# EAGLE design knxhome (EAGLE 9.1.3)
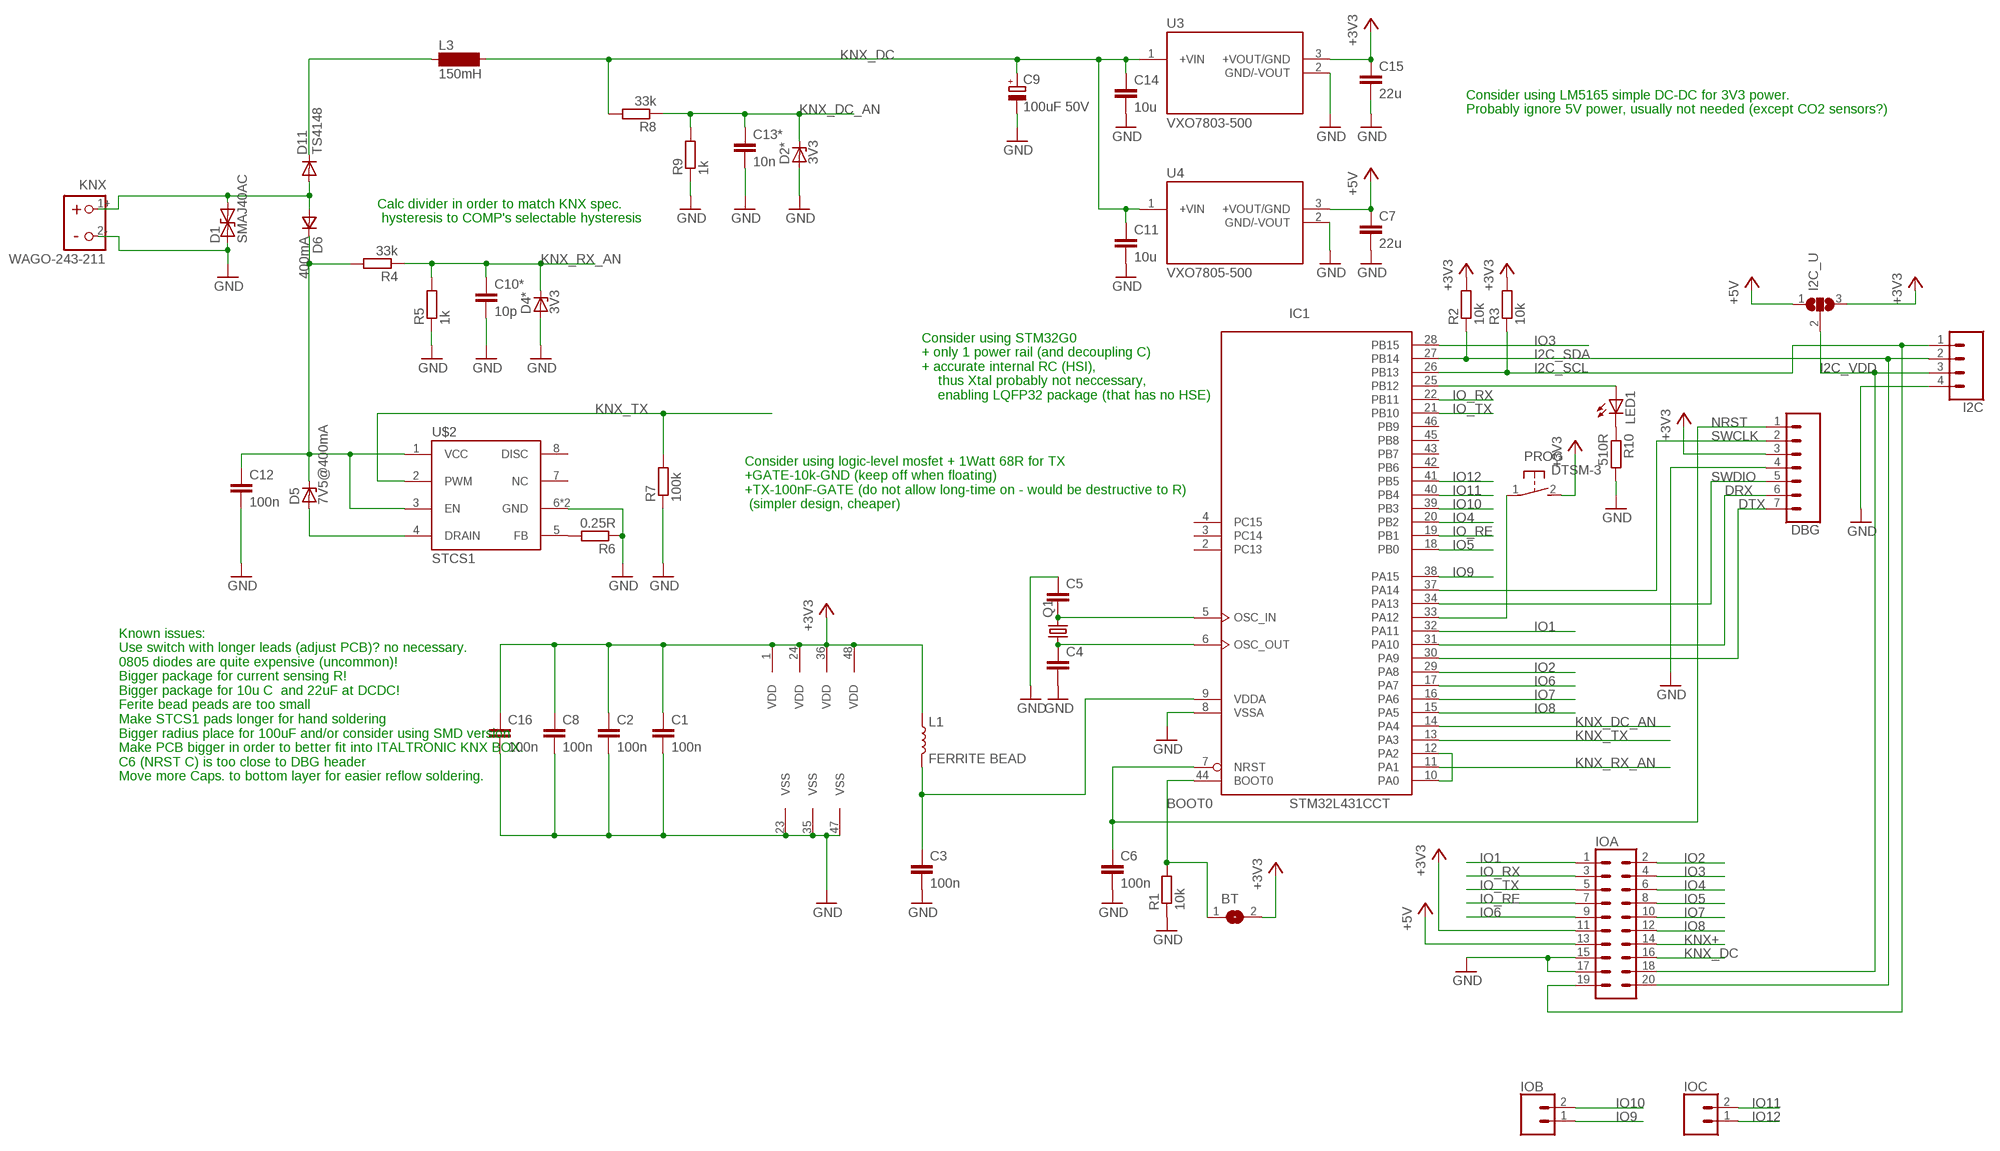
[diagram p0: schematic, sheet 1]

## Parts
BT  SJ  [SJ]
C1  100n  C-EUC0805  [C0805]
C2  100n  C-EUC0805  [C0805]
C3  100n  C-EUC0805  [C0805]
C4  C-EUC0805  [C0805]
C5  C-EUC0805  [C0805]
C6  100n  C-EUC0805  [C0805]
C7  22u  C-EUC0805  [C0805]
C8  100n  C-EUC0805  [C0805]
C9  100uF 50V  CPOL-EUE3.5-8  [E3,5-8]
C10*  10p  C-EUC0805  [C0805]
C11  10u  C-EUC0805  [C0805]
C12  100n  C-EUC0805  [C0805]
C13*  10n  C-EUC0805  [C0805]
C14  10u  C-EUC0805  [C0805]
C15  22u  C-EUC0805  [C0805]
C16  100n  C-EUC0805  [C0805]
D1  SMAJ40AC  [DO-214AC]
D2*  3V3  ZENER-DIODESOT23  [SOT23]
D4*  3V3  ZENER-DIODESOT23  [SOT23]
D5  7V5@400mA  ZENER-DIODESMB  [SMB]
D6  400mA  DSOD323  [SOD323]
D11  TS4148  DIODE-D0805  [D0805]
DBG  CONN_07LOCK  [1X07_LOCK]
I2C  CONN_04JST-PTH-VERT  [JST-4-PTH-VERT]
I2C_U  SJ2W  [SJ_2]
IC1  STM32L431CCT  STM32L051C8T  [LQFP48]
IOA  CONN_10X2  [2X10]
IOB  CONN_02  [1X02]
IOC  CONN_02  [1X02]
KNX  WAGO-243-211  [WAGO-243-211]
L1  FERRITE BEAD  INDUCTOR-0805-3.3UH  [0805]
L3  150mH  SD12BS11_LIEGEND  [BS11_LIEGEND]
LED1  LED3MM  [LED3MM]
PROG  DTSM-3  [DTSM-3]
Q1  CRYSTALHC49S  [HC49/S]
R1  10k  R-EU_R0805  [R0805]
R2  10k  R-EU_R0805  [R0805]
R3  10k  R-EU_R0805  [R0805]
R4  33k  R-EU_R0805  [R0805]
R5  1k  R-EU_R0805  [R0805]
R6  0.25R  R-EU_R0805  [R0805]
R7  100k  R-EU_R0805  [R0805]
R8  33k  R-EU_R0805  [R0805]
R9  1k  R-EU_R0805  [R0805]
R10  510R  R-EU_R0805  [R0805]
U3  VXO7803-500  [CONV_VXO7803-500]
U4  VXO7805-500  VXO7803-500  [CONV_VXO7803-500]
U$2  STCS1  [POWERSO-8]

## Nets
+3V3: BT.2 C1.1 C2.1 C8.1 C15.1 C16.1 DBG.3 I2C_U.3 IC1.1(VDD) IC1.24(VDD) IC1.36(VDD) IC1.48(VDD) IOA.11 L1.1 PROG.2 R2.2 R3.2 U3.3(+VOUT/GND)
+5V: C7.1 I2C_U.1 IOA.13 U4.3(+VOUT/GND)
BOOT0: BT.1 IC1.44(BOOT0) R1.2
BTN: IC1.33(PA12) PROG.1
DRX: DBG.6 IC1.31(PA10)
DTX: DBG.7 IC1.30(PA9)
GND: C1.2 C2.2 C3.2 C4.2 C5.1 C6.2 C7.2 C8.2 C9.- C10*.2 C11.2 C12.2 C13*.2 C14.2 C15.2 C16.2 D1.A D2*.1(A) D4*.1(A) DBG.4 I2C.4 IC1.8(VSSA) IC1.23(VSS) IC1.35(VSS) IC1.47(VSS) IOA.15 IOA.17 KNX.2- R1.1 R5.1 R6.1 R7.1 R9.1 R10.2 U3.2(GND/-VOUT) U4.2(GND/-VOUT) U$2.6(GND) U$2.EX(GND)
I2C_SCL: I2C.1 IC1.26(PB13) IOA.19 R3.1
I2C_SDA: I2C.2 IC1.27(PB14) IOA.20 R2.1
I2C_VDD: I2C.3 I2C_U.2 IOA.18
IO1: IC1.32(PA11) IOA.1
IO2: IC1.29(PA8) IOA.2
IO3: IC1.28(PB15) IOA.4
IO4: IC1.20(PB2) IOA.6
IO5: IC1.18(PB0) IOA.8
IO6: IC1.17(PA7) IOA.9
IO7: IC1.16(PA6) IOA.10
IO8: IC1.15(PA5) IOA.12
IO9: IC1.38(PA15) IOB.1
IO10: IC1.39(PB3) IOB.2
IO11: IC1.40(PB4) IOC.2
IO12: IC1.41(PB5) IOC.1
IO_RE: IC1.19(PB1) IOA.7
IO_RX: IC1.22(PB11) IOA.3
IO_TX: IC1.21(PB10) IOA.5
KNX+ [power]: D1.C D6.2(A) D11.A IOA.14 KNX.1+
KNX_DC: C9.+ C11.1 C14.1 IOA.16 L3.2 R8.2 U3.1(+VIN) U4.1(+VIN)
KNX_DC_AN: C13*.1 D2*.3(C) IC1.14(PA4) R8.1 R9.2
KNX_RECT: C12.1 D5.C D6.1(C) R4.2 U$2.1(VCC) U$2.3(EN)
KNX_RX_AN: C10*.1 D4*.3(C) IC1.11(PA1) R4.1 R5.2
KNX_TX: IC1.13(PA3) R7.2 U$2.2(PWM)
LED: IC1.25(PB12) LED1.A
N$1: D11.C L3.1
N$3: R6.2 U$2.5(FB)
N$4: LED1.K(C) R10.1
N$5: IC1.10(PA0) IC1.12(PA2)
N$7: C4.1 IC1.6(OSC_OUT) Q1.1
N$8: C5.2 IC1.5(OSC_IN) Q1.2
NRST: C6.1 DBG.1 IC1.7(NRST)
REF: D5.A U$2.4(DRAIN)
SWCLK: DBG.2 IC1.37(PA14)
SWDIO: DBG.5 IC1.34(PA13)
VDDA: C3.1 IC1.9(VDDA) L1.2
Unconnected: IC1.2(PC13) IC1.3(PC14) IC1.4(PC15) IC1.42(PB6) IC1.43(PB7) IC1.45(PB8) IC1.46(PB9) U$2.7(NC) U$2.8(DISC)

## Notes on the sheet
- Consider using LM5165 simple DC-DC for 3V3 power.
  Probably ignore 5V power, usually not needed (except CO2 sensors?)
- Calc divider in order to match KNX spec.
   hysteresis to COMP's selectable hysteresis
- Consider using STM32G0
  + only 1 power rail (and decoupling C)
  + accurate internal RC (HSI), 
      thus Xtal probably not neccessary,
      enabling LQFP32 package (that has no HSE)
- Consider using logic-level mosfet + 1Watt 68R for TX
  +GATE-10k-GND (keep off when floating)
  +TX-100nF-GATE (do not allow long-time on - would be destructive to R)
   (simpler design, cheaper)
- Known issues:
  Use switch with longer leads (adjust PCB)? no necessary.
  0805 diodes are quite expensive (uncommon)!
  Bigger package for current sensing R!
  Bigger package for 10u C  and 22uF at DCDC!
  Ferite bead peads are too small
  Make STCS1 pads longer for hand soldering
  Bigger radius place for 100uF and/or consider using SMD version
  Make PCB bigger in order to better fit into ITALTRONIC KNX BOX.
  C6 (NRST C) is too close to DBG header
  Move more Caps. to bottom layer for easier reflow soldering.

## Library data of the parts
BT = jumper:SJ: SMD solder JUMPER
C1-C8 C10* C11 C12 C13* C14-C16 = rcl:C-EU: CAPACITOR, European symbol; SPICEPREFIX: C
C9 = rcl:CPOL-EU: POLARIZED CAPACITOR, European symbol
D1 = diode:SMAJ40AC
D2* D4* D5 = diode:ZENER-DIODE: Z-Diode
D6 = zetex:D: DIODE; MPN: CDSOD323-T05C; OC_FARNELL: 1824860; OC_NEWARK: 79R6078
D11 = diode:DIODE-: DIODE
DBG = SparkFun-Connectors:CONN_07: Multi connection point. Often used as Generic Header-pin footprint for 0.1 inch spaced/style header connections On any of the 0.1 inch spaced packages, you can populate with these: Break Away Headers - Straight <https://www.sparkfun.com/products/116> (PRT-00116) Break Away Male Headers - Right Angle <https://www.sparkfun.com/products/553> (PRT-00553) Female Headers <https://www.sparkfun.com/products/115> (PRT-00115) Break Away Headers - Machine Pin <https://www.sparkfun.com/products/117> (PRT-00117) Break Away Female Headers - Swiss Machine Pin <https://www.sparkfun.com/products/743> (PRT-00743) For SCREWTERMINALS and SPRING TERMINALS visit here: Screw Terimnals on SparkFun.com <https://www.sparkfun.com/search/results?term=Screw+Terminals> (5mm/3.5mm/2.54mm spacing) This device is also useful as a general connection point to wire up your design to another part of your project. Our various solder wires solder well into these plated through hole pads. Hook-Up Wire - Assortment (Stranded, 22 AWG) <https://www.sparkfun.com/products/11375> (PRT-11375) Hook-Up Wire - Assortment (Solid Core, 22 AWG) <https://www.sparkfun.com/products/11367> (PRT-11367) View the entire wire category on our website here <https://www.sparkfun.com/categories/141> Special notes: Molex polarized connector foot print use with SKU : PRT-08231 with associated crimp pins and housings. 1MM SMD Version SKU: PRT-10208 NOTES ON THE VARIANTS LOCK and LOCK_LONGPADS... This footprint was designed to help hold the alignment of a through-hole component (i.e. 6-pin header) while soldering it into place. You may notice that each hole has been shifted either up or down by 0.005 of an inch from it's more standard position (which is a perfectly straight line). This slight alteration caused the pins (the squares in the middle) to touch the edges of the holes. Because they are alternating, it causes a "brace" to hold the component in place. 0.005 has proven to be the perfect amount of "off-center" position when using our standard breakaway headers. Although looks a little odd when you look at the bare footprint, once you have a header in there, the alteration is very hard to notice. Also,if you push a header all the way into place, it is covered up entirely on the bottom side.
I2C = SparkFun-Connectors:CONN_04: Multi connection point. Often used as Generic Header-pin footprint for 0.1 inch spaced/style header connections On any of the 0.1 inch spaced packages, you can populate with these: Break Away Headers - Straight <https://www.sparkfun.com/products/116> (PRT-00116) Break Away Male Headers - Right Angle <https://www.sparkfun.com/products/553> (PRT-00553) Female Headers <https://www.sparkfun.com/products/115> (PRT-00115) Break Away Headers - Machine Pin <https://www.sparkfun.com/products/117> (PRT-00117) Break Away Female Headers - Swiss Machine Pin <https://www.sparkfun.com/products/743> (PRT-00743) For SCREWTERMINALS and SPRING TERMINALS visit here: Screw Terimnals on SparkFun.com <https://www.sparkfun.com/search/results?term=Screw+Terminals> (5mm/3.5mm/2.54mm spacing) This device is also useful as a general connection point to wire up your design to another part of your project. Our various solder wires solder well into these plated through hole pads. Hook-Up Wire - Assortment (Stranded, 22 AWG) <https://www.sparkfun.com/products/11375> (PRT-11375) Hook-Up Wire - Assortment (Solid Core, 22 AWG) <https://www.sparkfun.com/products/11367> (PRT-11367) View the entire wire category on our website here <https://www.sparkfun.com/categories/141> Special notes: Molex polarized connector foot print use with SKU : PRT-08231 with associated crimp pins and housings. 1MM SMD Version SKU: PRT-10208; PROD_ID: CONN-13251
I2C_U = jumper:SJ2W: SMD solder JUMPER
IC1 = micro-stm_v3:STM32L051C*T: ARM 32-bit Cortex™-M0+ CPU 32 MHz maximum frequency 32 to 64 Kbytes of Flash memory 2 kbyte of Data EEPROM 8 kbytes of SRAM 37 GPIOs 1.8 to 3.6 V application supply
IOA = SparkFun-Connectors:CONN_10X2: Multi connection point. Often used as Generic Header-pin footprint for 0.1 inch spaced/style header connections On any of the 0.1 inch spaced packages, you can populate with these: Break Away Headers - Straight <https://www.sparkfun.com/products/116> (PRT-00116) Break Away Male Headers - Right Angle <https://www.sparkfun.com/products/553> (PRT-00553) Female Headers <https://www.sparkfun.com/products/115> (PRT-00115) Break Away Headers - Machine Pin <https://www.sparkfun.com/products/117> (PRT-00117) Break Away Female Headers - Swiss Machine Pin <https://www.sparkfun.com/products/743> (PRT-00743) Special note about the "SPECIAL" package: This was SPECIALLY designed to be used with our Graphic LCD Backpack. Be sure you want to use this! It is not only staggered on each line of header holes, but IT IS ALSO offset of the center point of the top and bottom lines by 5 mil. This causes the headers to lock into place on the "standard" footprint on the LCD screen. The extra squares on the tdocu layer are there simply to reference other pins (if you were to actually populate a longer header than ten long - this is what we do with the backpacks).
IOB IOC = SparkFun-Connectors:CONN_02: Multi connection point. Often used as Generic Header-pin footprint for 0.1 inch spaced/style header connections On any of the 0.1 inch spaced packages, you can populate with these: Break Away Headers - Straight <https://www.sparkfun.com/products/116> (PRT-00116) Break Away Male Headers - Right Angle <https://www.sparkfun.com/products/553> (PRT-00553) Female Headers <https://www.sparkfun.com/products/115> (PRT-00115) Break Away Headers - Machine Pin <https://www.sparkfun.com/products/117> (PRT-00117) Break Away Female Headers - Swiss Machine Pin <https://www.sparkfun.com/products/743> (PRT-00743) For SCREWTERMINALS and SPRING TERMINALS visit here: Screw Terimnals on SparkFun.com <https://www.sparkfun.com/search/results?term=Screw+Terminals> (5mm/3.5mm/2.54mm spacing) This device is also useful as a general connection point to wire up your design to another part of your project. Our various solder wires solder well into these plated through hole pads. Hook-Up Wire - Assortment (Stranded, 22 AWG) <https://www.sparkfun.com/products/11375> (PRT-11375) Hook-Up Wire - Assortment (Solid Core, 22 AWG) <https://www.sparkfun.com/products/11367> (PRT-11367) View the entire wire category on our website here <https://www.sparkfun.com/categories/141> Special notes: Molex polarized connector foot print use with: PRT-08233 with associated crimp pins and housings. 2.54_SCREWTERM for use with PRT-10571. 3.5mm Screw Terminal footprints for PRT-08084 5mm Screw Terminal footprints for use with PRT-08432
KNX = Connector_for_Selfbus-Projects:WAGO-243-211: WAGO KNX-Busklemme
L1 = SparkFun-Coils:INDUCTOR: Inductors Resist changes in electrical current. Basically a coil of wire. SparkFun Products: SparkFun Load Cell Amplifier - HX711 <https://www.sparkfun.com/products/13879> IOIO-OTG - V2.2 <https://www.sparkfun.com/products/13613>; PROD_ID: NDUC-13076; VALUE: 3.3µH/±20%/450mA
L3 = inductor-neosid:SD12: INDUCTOR nominal inductance
LED1 = led:LED: LED OSRAM: - CHIPLED LG R971, LG N971, LY N971, LG Q971, LY Q971, LO R971, LY R971 LH N974, LH R974 LS Q976, LO Q976, LY Q976 LO Q996 - Hyper CHIPLED LW Q18S LB Q993, LB Q99A, LB R99A - SideLED LS A670, LO A670, LY A670, LG A670, LP A670 LB A673, LV A673, LT A673, LW A673 LH A674 LY A675 LS A676, LA A676, LO A676, LY A676, LW A676 LS A679, LY A679, LG A679 - Hyper Micro SIDELED® LS Y876, LA Y876, LO Y876, LY Y876 LT Y87S - SmartLED LW L88C, LW L88S LB L89C, LB L89S, LG L890 LS L89K, LO L89K, LY L89K LS L896, LA L896, LO L896, LY L896 - TOPLED LS T670, LO T670, LY T670, LG T670, LP T670 LSG T670, LSP T670, LSY T670, LOP T670, LYG T670 LG T671, LOG T671, LSG T671 LB T673, LV T673, LT T673, LW T673 LH T674 LS T676, LA T676, LO T676, LY T676, LB T676, LH T676, LSB T676, LW T676 LB T67C, LV T67C, LT T67C, LS T67K, LO T67K, LY T67K, LW E67C LS E67B, LA E67B, LO E67B, LY E67B, LB E67C, LV E67C, LT E67C LW T67C LS T679, LY T679, LG T679 LS T770, LO T770, LY T770, LG T770, LP T770 LB T773, LV T773, LT T773, LW T773 LH T774 LS E675, LA E675, LY E675, LS T675 LS T776, LA T776, LO T776, LY T776, LB T776 LHGB T686 LT T68C, LB T68C - Hyper Mini TOPLED® LB M676 - Mini TOPLED Santana® LG M470 LS M47K, LO M47K, LY M47K Source: http://www.osram.convergy.de LUXEON: - LUMILED® LXK2-PW12-R00, LXK2-PW12-S00, LXK2-PW14-U00, LXK2-PW14-V00 LXK2-PM12-R00, LXK2-PM12-S00, LXK2-PM14-U00 LXK2-PE12-Q00, LXK2-PE12-R00, LXK2-PE12-S00, LXK2-PE14-T00, LXK2-PE14-U00 LXK2-PB12-K00, LXK2-PB12-L00, LXK2-PB12-M00, LXK2-PB14-N00, LXK2-PB14-P00, LXK2-PB14-Q00 LXK2-PR12-L00, LXK2-PR12-M00, LXK2-PR14-Q00, LXK2-PR14-R00 LXK2-PD12-Q00, LXK2-PD12-R00, LXK2-PD12-S00 LXK2-PH12-R00, LXK2-PH12-S00 LXK2-PL12-P00, LXK2-PL12-Q00, LXK2-PL12-R00 Source: www.luxeon.com KINGBRIGHT: KA-3528ASYC Source: www.kingbright.com
PROG = switch-tact:DTSM-3
Q1 = crystal:CRYSTAL: CRYSTAL; OC_FARNELL: 1667008; OC_NEWARK: unknown
R1-R10 = rcl:R-EU_: RESISTOR, European symbol; SPICEPREFIX: R
U3 U4 = VXO7803-500:VXO7803-500; MANUFACTURER: CUI Inc; PARTREV: 1.0; STANDARD: Manufacturer recommendations
U$2 = Synapseware:STCS1: 1.5 A max constant current LED driver

## Net classes
1 power: width 0.305 mm

## Board
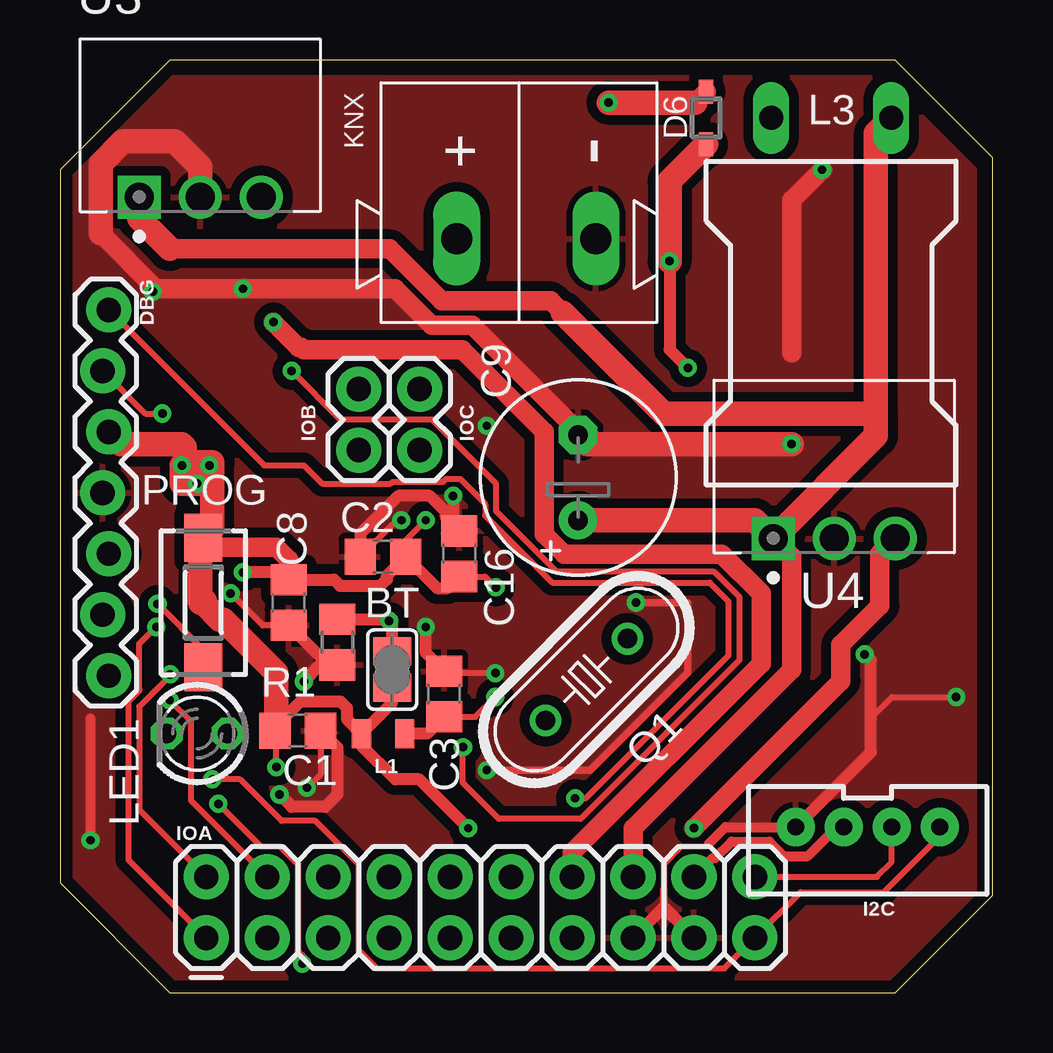
[diagram p1: board, top side]
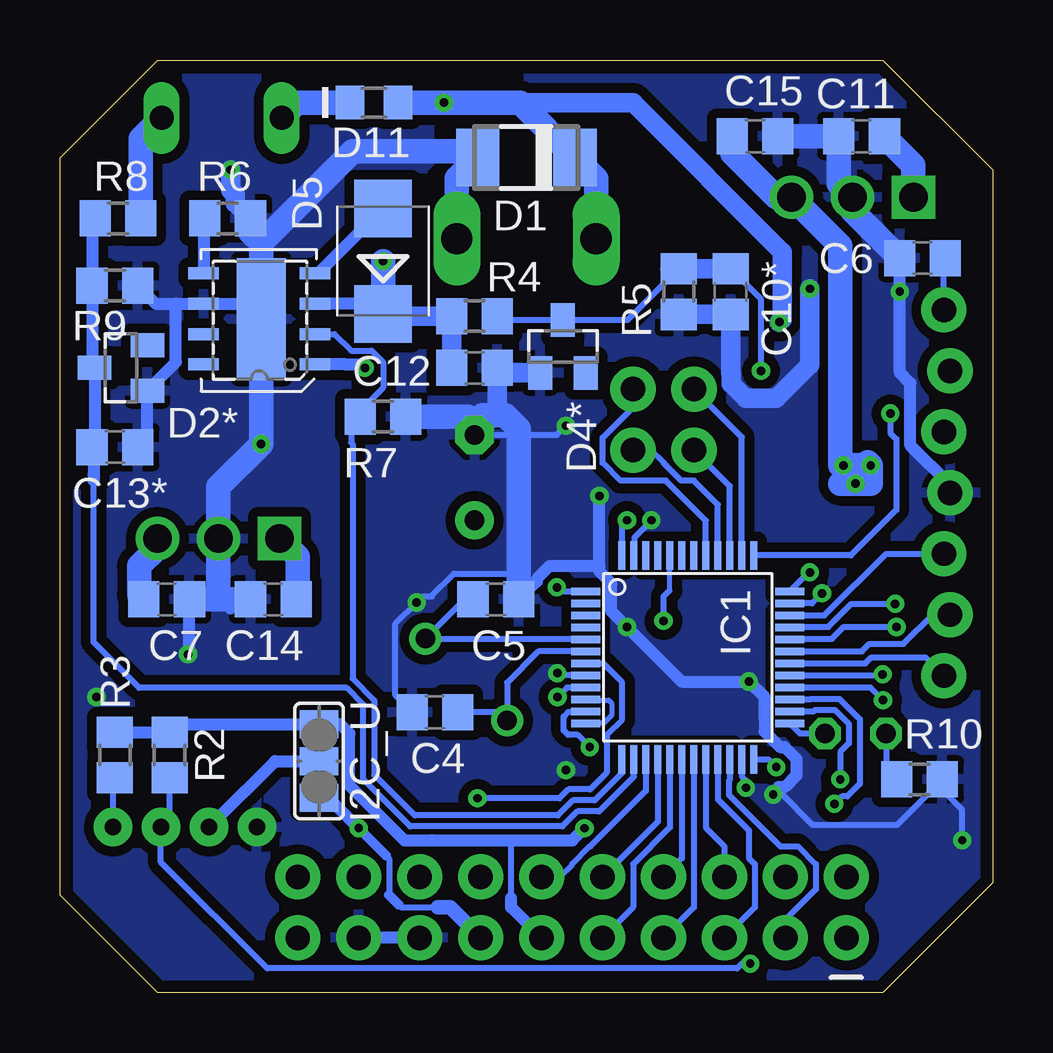
[diagram p2: board, bottom side, seen from below]

Size 38.86 x 38.86 mm. Coordinates in mm from the lower left corner, seen from the top.
Outline: 38.86,4.06 38.86,34.8 34.8,38.86 4.57,38.86 0,34.29 0,4.57 4.57,0 34.8,0 38.86,4.06
Copper layers (1*16): Top 0.035mm / dielectric 1.5mm / Bottom 0.035mm
Design rules "default *": minimum track width 8mil, minimum drill 0.35mm, track to track 8mil, track to pad 8mil, pad to pad 6mil, via to via 8mil, smd to smd 6mil, copper to edge 20mil, drill to drill 6mil, minimum pad ring 10mil, minimum via ring 8mil, stop-mask expansion 4mil, vias tented up to drill 40mil, thermal gap 10mil
bRestrict: 3 lines

### Footprints (pad centres in the part's own frame; a part is rotated, then mirrored left to right if it is on the bottom)
SJ = smd 1.168 x 1.6: 1 -0.762,0; 2 0.762,0
C0805 = smd 1.3 x 1.5: 1 -0.95,0; 2 0.95,0
E3,5-8 = drill 0.813 pad 1.6: + -1.778,0 | drill 0.813 pad 1.6 octagon: - 1.778,0
DO-214AC = smd 1.8 x 2.4: A 2.025,0; C -2.025,0
SOT23 = smd 1 x 1.4: 1 -0.95,-1.1; 2 0.95,-1.1; 3 0,1.1
SMB = smd 2.4 x 2.4: A 2.2,0; C -2.2,0
SOD323 = smd 1 x 0.6: 1 -1.1,0; 2 1.1,0
D0805 = smd 1.2 x 1.4: A 1,0; C -1,0
1X07_LOCK = drill 1.016 pad 1.88: 1 0,0.127; 2 2.54,-0.127; 3 5.08,0.127; 4 7.62,-0.127; 5 10.16,0.127; 6 12.7,-0.127; 7 15.24,0.127
JST-4-PTH-VERT = drill 0.7 pad 1.6: 1 -3,-0.55; 2 -1,-0.55; 3 1,-0.55; 4 3,-0.55
SJ_2 = smd 1.168 x 1.6: 1 -1.524,0; 2 0,0; 3 1.524,0
LQFP48 = smd 0.3 x 1.2: 1 -2.75,-4.25; 2 -2.25,-4.25; 3 -1.75,-4.25; 4 -1.25,-4.25; 5 -0.75,-4.25; 6 -0.25,-4.25; 7 0.25,-4.25; 8 0.75,-4.25; 9 1.25,-4.25; 10 1.75,-4.25; 11 2.25,-4.25; 12 2.75,-4.25; 25 2.75,4.25; 26 2.25,4.25; 27 1.75,4.25; 28 1.25,4.25; 29 0.75,4.25; 30 0.25,4.25; 31 -0.25,4.25; 32 -0.75,4.25; 33 -1.25,4.25; 34 -1.75,4.25; 35 -2.25,4.25; 36 -2.75,4.25 | smd 1.2 x 0.3: 13 4.25,-2.75; 14 4.25,-2.25; 15 4.25,-1.75; 16 4.25,-1.25; 17 4.25,-0.75; 18 4.25,-0.25; 19 4.25,0.25; 20 4.25,0.75; 21 4.25,1.25; 22 4.25,1.75; 23 4.25,2.25; 24 4.25,2.75; 37 -4.25,2.75; 38 -4.25,2.25; 39 -4.25,1.75; 40 -4.25,1.25; 41 -4.25,0.75; 42 -4.25,0.25; 43 -4.25,-0.25; 44 -4.25,-0.75; 45 -4.25,-1.25; 46 -4.25,-1.75; 47 -4.25,-2.25; 48 -4.25,-2.75
2X10 = drill 1.016 pad 1.88: 1 0,0; 2 0,2.54; 3 2.54,0; 4 2.54,2.54; 5 5.08,0; 6 5.08,2.54; 7 7.62,0; 8 7.62,2.54; 9 10.16,0; 10 10.16,2.54; 11 12.7,0; 12 12.7,2.54; 13 15.24,0; 14 15.24,2.54; 15 17.78,0; 16 17.78,2.54; 17 20.32,0; 18 20.32,2.54; 19 22.86,0; 20 22.86,2.54
1X02 = drill 1.016 pad 1.88: 1 0,0; 2 2.54,0
WAGO-243-211 = drill 1.3 long: 1+ 0,2.65; 2- 0,-3.15
0805 = smd 0.8 x 1.2: 1 -0.9,0; 2 0.9,0
BS11_LIEGEND = drill 1 long: 1 -2.5,0; 2 2.5,0
LED3MM = drill 0.813 octagon: A -1.27,0; K 1.27,0
DTSM-3 = smd 2 x 1.6: 1 -2.7,0; 2 2.7,0
HC49/S = drill 0.813: 1 -2.413,0; 2 2.413,0
R0805 = smd 1.3 x 1.5: 1 -0.95,0; 2 0.95,0
CONV_VXO7803-500 = drill 1.2 square: 1 0,0 | drill 1.2: 2 2.54,0; 3 5.08,0
POWERSO-8 = smd 0.5 x 1.27: 1 -1.879,-2.247; 2 -0.625,-2.247; 3 0.644,-2.247; 4 1.913,-2.247; 5 1.918,2.4; 6 0.649,2.395; 7 -0.626,2.399; 8 -1.879,2.4 | smd 5.08 x 2.032: EX 0,0

### Placement (x,y rotation side)
BT  13.84,13.46 270 top
C1  9.91,10.92 0 top
C2  13.46,18.16 180 top
C3  16,12.45 90 top
C4  23.24,11.68 180 bottom
C5  20.7,16.38 180 bottom
C6  2.92,30.61 180 bottom
C7  34.42,16.38 0 bottom
C8  9.53,16.26 270 top
C9  21.59,21.46 90 top
C10*  10.92,29.21 270 bottom
C11  5.46,35.69 180 bottom
C12  21.59,26.04 0 bottom
C13*  36.58,22.73 0 bottom
C14  29.97,16.38 180 bottom
C15  9.91,35.69 0 bottom
C16  16.64,18.29 90 top
D1  19.43,34.8 180 bottom
D2*  36.32,26.04 90 bottom
D4*  17.91,26.92 0 bottom
D5  25.4,30.48 90 bottom
D6  26.92,36.45 90 top
D11  25.78,37.08 0 bottom
DBG  1.91,28.45 270 top
I2C  33.66,6.35 180 top
I2C_U  28.07,9.65 90 bottom
IC1  12.7,13.97 270 bottom
IOA  6.1,2.29 0 top
IOB  12.45,25.15 270 top
IOC  14.99,25.15 270 top
KNX  19.18,31.42 90 top
L1  13.46,10.79 0 top
L3  32.13,36.45 0 top
LED1  5.71,10.79 180 top
PROG  5.97,16.26 90 top
Q1  21.93,13.04 45 top
R1  11.56,14.61 90 top
R2  34.29,9.91 90 bottom
R3  36.58,9.91 90 bottom
R4  21.59,28.19 180 bottom
R5  13.08,29.21 90 bottom
R6  31.88,32.26 180 bottom
R7  25.4,24 180 bottom
R8  36.45,32.26 0 bottom
R9  36.58,29.46 180 bottom
R10  3.05,8.89 0 bottom
U3  3.3,33.15 0 top
U4  29.72,18.92 0 top
U$2  30.48,28.07 90 bottom

### Tracks (layer width: path | path; a pad name or v marks a point on that pad's centre or on a via)
+3V3  (via drill 0.35)
  Top 0.254: C16.1 17.71,17.34 v18.16,16.89 | C2.1 14.41,18.86 v15.24,19.68 | v9.02,9.4 9.02,10.86 C1.1 | PROG.2 5.97,18.68 5.84,18.55
  Top 0.508: C16.1 16.16,16.86 15.71,16.86 C2.1 13.62,17.37 13.62,17.22 13.35,16.95 11.67,16.95 11.42,17.21 C8.1 9.22,17.51 v7.62,17.51 | L1.1 13.84,12.08 BT.2 | L1.1 11.96,11.39 11.96,11.86 11.7,12.13 10.02,12.13 9.32,11.43 8.89,11.43 8.89,10.99 C1.1 | v17.01,6.85 14.97,8.89 13.97,8.89 12.56,10.3 L1.1
  Top 0.813: C8.1 9.53,18.03 9.01,18.55 5.84,18.55
  Top 1.016: 5.84,18.55 5.84,16.51 | 5.84,16.51 5.84,16.26 | 5.84,16.51 6.02,16.33 6.02,16.19 6.66,15.55 6.8,15.55 9.02,13.34 9.02,10.86 | 6.35,21.21 v5.71,21.21 5.08,21.21 v5.08,21.97 5.21,22.1 | PROG.2 6.35,19.34 6.35,22.1 5.21,22.1 | DBG.3 2.54,22.86 5.08,22.86 5.21,22.73 5.21,22.1
  Bottom 0.254: v18.16,16.89 17.99,16.72 IC1.1 | v15.24,19.68 15.45,19.48 IC1.48 | 23.36,6.35 23.36,6.48 | IC1.24 9.34,9.72 v9.02,9.4 | IC1.36 7.66,17.51 | 20.07,3.94 20.07,6.35
  Bottom 0.508: R3.2 R2.2 33.97,11.18 I2C_U.3 27.18,11.18 26.81,10.81 26.81,8.65 24.51,6.35 23.36,6.35 20.07,6.35 17.51,6.35 v17.01,6.85 | v7.62,17.51 7.66,17.51 | IOA.11 20.07,3.56 20.07,3.94
  Bottom 1.016: C15.1 10.86,34.99 9.02,33.15 U3.3 6.35,31.11 6.35,21.97 v6.22,21.97 5.33,21.97 5.21,22.1 v5.08,21.97 5.08,21.21 v5.71,21.21 6.35,21.21
+5V  (via drill 0.35)
  Top 0.813: U4.3 34.16,18.29 34.16,16.13 32.54,14.51 32.54,12.98 v26.42,6.86
  Bottom 0.254: 25.27,5.71 25.15,5.59 25.15,4.06 | 24.77,3.68 24.64,3.56 23.11,3.56
  Bottom 0.406: v26.42,6.86 25.27,5.71 | 25.15,4.06 24.77,3.68
  Bottom 0.508: v26.42,6.86 27.69,8.13 I2C_U.1
  Bottom 0.61: 23.11,3.56 22.61,3.56 IOA.13
  Bottom 1.016: U4.3 34.8,18.54 35.56,17.78 35.56,16.58 C7.1
BOOT0  (via drill 0.35)
  Top 0.254: 13.84,15.37 v13.72,15.49
  Top 0.508: R1.2 13.65,15.55 13.84,15.37 BT.1
  Bottom 0.203: 13.46,16.76 13.46,18.21 IC1.44
  Bottom 0.254: v13.72,15.49 13.72,16.51 13.46,16.76
BTN  (via drill 0.35)
  Top 0.254: v4.06,16.2 5.97,14.29 PROG.1
  Bottom 0.254: IC1.33 8.43,15.24 6.85,15.24 5.89,16.2 v4.06,16.2
DRX
  Bottom 0.254: DBG.6 2.5,15.75 3.72,14.53 5.14,14.53 5.45,14.22 IC1.31
DTX
  Bottom 0.254: 8.43,13.74 IC1.30 5.31,13.72 5.06,13.97 2.79,13.97 DBG.7
GND  (via drill 0.35)
  Top 0.254: v18.14,13.31 16.09,13.31 C3.2 | C2.2 14.04,19.68 v14.22,19.68 | C8.2 8.44,15.31 v7.11,16.64 | C1.2 10.86,9.11 v10.29,8.54 | 27.05,6.22 26.92,6.1 25.89,6.1 25.15,5.35 25.15,4.3 | 33.78,11.43 34.67,12.32 v37.34,12.32
  Top 0.305: 25.15,4.3 25.15,3.56 | v24,16.26 26.16,16.26 26.16,13.34 22.1,9.27 v17.78,9.27 17.65,9.27
  Top 0.406: 27.05,6.22 27.73,6.9 I2C.4 | 1.27,11.43 v1.27,6.35
  Top 0.508: 12.12,18.16 C2.2 12.51,19.12 14.1,20.7 15.4,20.7 16.07,20.03 16.07,19.8 C16.2 16.38,19.49 v16.38,20.7 | C8.2 11.18,13.65 R1.1 10.85,13.65 v10.16,12.96 | C1.2 11.56,10.22 11.56,8.26 11.05,7.75 9.65,7.75 v9.14,8.26 | C3.2 15.24,14.16 v15.24,15.24 | IOA.17 25.15,3.56 IOA.15 | I2C.4 33.78,10.03 33.78,11.43 33.78,13.84 v33.53,14.1 | 5.08,29.33 4.96,29.21 v3.87,29.21
  Top 0.813: v31.75,34.29 30.48,33.02 30.48,26.67 | C9.- 21.2,23.64 21.2,23.8 17.18,27.81 15.48,27.81 13.96,29.33 v7.62,29.33 5.08,29.33 4,29.33 1.69,31.64
  Top 1.016: 1.69,31.64 1.69,34.54 2.62,35.48 4.78,35.48 5.84,34.42 U3.2 | v30.48,22.86 21.97,22.86 | 21.97,22.86 C9.- | 21.97,22.86 21.97,23.16
  Bottom 0.254: IC1.8 18.05,13.22 v18.14,13.31 | IC1.47 14.93,18.24 14.93,18.96 14.22,19.66 v14.22,19.68 | v7.11,16.64 7.53,16.22 IC1.35 | v10.29,8.54 10.29,8.84 10.43,8.98 10.43,9.7 IC1.23 | 19.75,17.78 20.07,17.46 22.44,17.46 23.37,16.53 23.37,16.51 23.75,16.51 v24,16.26 24.89,15.37 24.89,12.38 C4.2 | 9.51,11.43 9.38,11.3 9.38,10.76 | v9.14,8.27 v9.14,8.26 | R10.2 2.32,8.67 | 2.32,8.67 4,6.99 7.49,6.99 8.85,8.34 9.14,8.34 | v1.27,6.35 1.27,7.62 2.32,8.67 | C9.- 18.16,23.24 v17.78,23.62
  Bottom 0.508: U$2.EX 31.13,28.72 U$2.6 34.04,28.72 | R9.1 34.88,28.72 34.04,28.72 | 34.04,28.72 34.04,26.27 D2*.1 35.22,23.14 C13*.2 | v9.14,8.26 9.14,8.34 8.93,8.56 8.67,8.56 8.18,9.05 8.18,9.74 8.67,10.23 8.86,10.23 9.51,10.88 9.51,11.43 9.51,12.31 v10.16,12.96 12.96,12.96 v15.24,15.24 15.89,15.89 15.89,17.06 16.38,17.55 16.38,17.78 | 16.38,17.78 v16.38,20.7 | C5.1 19,17.14 19,17.24 18.45,17.78 16.38,17.78 | 31.75,16 32.26,16.51 | IOA.15 IOA.17 | DBG.4 1.78,21.14 3.43,22.79 3.43,25.4 3.87,25.84 v3.87,29.21 C6.2 | 5.46,32.77 U3.2 | v33.53,14.1 33.47,14.16 C7.2
  Bottom 0.813: R6.1 31.57,32.9 31.57,33.26 31.75,33.44 v31.75,34.29 | D4*.1 20.43,25.82 C12.2 20.64,24.19 C9.- | R5.1 C10*.2 10.92,25.81 10.9,25.79 10.9,25.38 10.29,24.77 9.02,24.77 7.62,26.16 v7.62,29.33
  Bottom 1.016: KNX.2- 22.33,33.93 D1.A 21.71,35.05 26.67,35.05 30.48,31.24 | 30.48,31.24 U$2.EX v30.48,22.86 32.26,21.08 U4.2 32.26,16.51 32.26,16.38 | 30.48,31.24 30.93,31.69 R6.1 | C15.2 C11.2 6.41,33.72 U3.2 5.84,32.58 C6.2 | C14.2 32.26,16.38 | 32.26,16.38 C7.2 | C5.1 19.75,17.78 19.75,23.5 20.32,24.06 21.27,24.06 21.59,23.75 | R7.1 21.84,24 21.59,23.75 | C9.- 21.59,23.75
  pour Top (isolate 0.406): 0,34.29 0,5.08 5.08,0 34.29,0 38.1,3.81 38.1,5.08 38.1,34.29 34.29,38.1 5.08,38.1 3.81,38.1
  pour Bottom (isolate 0.406): 0,34.29 0,5.08 5.08,0 34.29,0 38.1,3.81 38.1,34.29 34.29,38.1 5.08,38.1 3.81,38.1
I2C_SCL  (via drill 0.35)
  Top 0.254: v6.35,8.89 7.51,8.89 9.23,7.16 10.63,7.16 12.45,5.35 12.45,1.76 13.19,1.02 27.69,1.02 IOA.19 30.86,4.19 34.32,4.19 36.66,6.53 | 36.83,6.35 36.66,6.53 | 36.66,6.53 I2C.1
  Bottom 0.254: 8.43,11.7 IC1.26 7.46,11.72 7.39,11.79 6.58,11.79 5.99,11.21 5.99,10.38 6.35,10.03 v6.35,8.89 | R3.1 36.66,8.88 I2C.1
I2C_SDA  (via drill 0.35)
  Top 0.254: I2C.2 34.66,5.45 34.04,4.83 IOA.20 | v10.1,1.21 10.1,1.57 9.91,1.76 9.91,5.4 9.86,5.4 9.16,6.1 8.37,6.1 v6.6,7.87
  Bottom 0.254: R2.1 34.29,7.26 I2C.2 34.66,5.45 30.23,1.02 10.65,1.02 10.46,1.21 v10.1,1.21 | 8.43,12.2 IC1.27 7.61,12.22 7.58,12.24 6.38,12.24 5.54,11.39 5.54,8.7 6.06,8.18 6.28,8.18 v6.6,7.87
I2C_VDD
  Top 0.406: IOA.18 27.2,5.61 27.3,5.61 27.98,6.29 29.56,6.29 30.16,5.69 31.16,5.69 32.36,6.9 I2C.3
  Bottom 0.508: I2C.3 31.21,8.35 31.17,8.38 29.9,9.65 I2C_U.2
IO1  (via drill 0.35)
  Top 0.254: 3.76,14.99 v4.01,15.24 3.3,14.53 3.3,12.7 3.3,12.68 3.3,12.57 2.85,12.11 2.85,5.54 IOA.1
  Bottom 0.254: IC1.32 8.43,14.74 6.7,14.74 6.2,15.24 v4.01,15.24
IO2  (via drill 0.35)
  Top 0.254: v4.59,13.26 4.59,13.21 3.94,12.57 3.86,12.48 3.3,11.92 3.3,7.62 IOA.2
  Bottom 0.254: v4.59,13.26 4.63,13.22 IC1.29
IO3  (via drill 0.35)
  Top 0.254: v4.57,12.19 5.46,11.3 5.46,8 IOA.4
  Bottom 0.254: v4.57,12.19 5.1,12.72 IC1.28
IO4
  Bottom 0.254: IC1.20 11.95,6.87 11.18,6.1 IOA.6
IO5
  Bottom 0.254: IC1.18 12.95,5.59 IOA.8
IO6
  Bottom 0.254: IC1.17 13.45,6.89 14.99,5.35 14.99,3.56 IOA.9
IO7
  Bottom 0.254: IC1.16 13.95,7.13 IOA.10
IO8
  Bottom 0.254: IC1.15 14.45,8.41 16.76,6.1 16.78,6.1 17.53,5.35 17.53,5.33 18.03,4.83 IOA.12
IO9
  Bottom 0.254: 10.43,18.24 IC1.38 10.45,23.15 IOB.1
IO10
  Bottom 0.254: 10.93,18.24 IC1.39 10.95,21.11 IOB.2
IO11
  Bottom 0.254: IC1.40 11.45,20.34 12.45,21.34 12.97,21.34 13.6,21.96 13.72,22.08 13.72,22.1 14.22,22.61 IOC.2
IO12
  Bottom 0.254: IC1.41 11.95,19.67 13.62,21.34 15.51,21.34 16.26,22.08 16.26,23.13 14.99,24.4 IOC.1
IO_RE
  Bottom 0.254: IC1.19 12.45,5.36 12.45,5.35 12.45,3.56 IOA.7
IO_RX
  Bottom 0.254: IC1.22 10.95,8.88 10.99,8.83 10.99,8.24 10.3,7.55 8.85,6.1 8.11,6.1 7.37,5.35 7.37,4.3 8.64,3.03 IOA.3
IO_TX
  Bottom 0.254: IC1.21 11.45,9.02 11.45,8.06 10.16,6.76 10.16,5.61 9.91,5.35 9.91,3.56 IOA.5
KNX+  (via drill 0.35)
  Top 0.813: IOA.14 21.34,5.84 29.21,13.72 29.21,16.64 27.57,18.27 21.01,18.27 20.18,19.1 20.18,23.38 16.76,26.8 10.16,26.8 10.06,26.9 9.93,26.9 v8.89,27.94 | 26.46,37.08 D6.2
  Top 1.016: v22.86,37.08 26.46,37.08
  Bottom 0.813: 19.69,37.08 14.99,37.08 8.76,30.86 8.76,28.07 v8.89,27.94
  Bottom 1.016: KNX.1+ 16.53,33.92 D1.C 19.69,37.08 v22.86,37.08 D11.A
KNX_DC
  Top 0.813: IOA.16 23.88,6.86 30.48,13.46 30.48,18.16 U4.1 | 21.46,27.81 20.45,28.83 15.9,28.83 13.74,30.99 4.57,30.99
  Top 1.016: 34,24.13 25.15,24.13 21.46,27.81 20.95,28.32 | 34,24.13 34,35.81 L3.2 | 34,24.13 34,23.2 U4.1 28.96,19.68 C9.+ | 4.57,30.99 3.3,32.26 U3.1
  Bottom 1.016: U3.1 3.3,34.48 C11.1 | U4.1 28.96,18.16 28.96,16.45 C14.1 | R8.2 35.5,35.58 L3.2
KNX_DC_AN
  Bottom 0.254: 14.97,9.7 IC1.14 14.95,9 16.39,7.56 17.3,7.56 17.93,6.93 24.27,6.93 26.23,8.89 26.23,12 26.92,12.7 35.56,12.7 37.47,14.61 37.47,21.59
  Bottom 0.508: R8.1 37.53,32.13 R9.2 37.53,26.14 D2*.3 37.42,22.84 C13*.1 37.47,22.67 37.47,21.59 37.47,21.34
KNX_RECT  (via drill 0.35)
  Top 0.508: v25.4,30.48 25.4,26.8 v26.16,26.04
  Top 1.016: D6.1 25.4,33.83 v25.4,30.48
  Bottom 0.508: D5.C 26.34,28.71 U$2.3 | v26.16,26.04 26.29,26.17 26.98,26.17 27,26.19 U$2.1
  Bottom 0.813: D5.C 25.31,28.19 R4.2 C12.1
  Bottom 1.016: v25.4,30.48 D5.C
KNX_RX_AN  (via drill 0.35)
  Top 0.254: v16.79,10.23 16.79,8.79 16.76,8.76 18.29,7.24 21.69,7.24 28.31,13.86 28.31,16.5 27.27,17.54 20.7,17.54 18.17,20.07 18.17,21.21 15.51,23.88 15.24,23.88 11.68,23.88 v9.65,25.91
  Bottom 0.254: IC1.11 16.97,11.7 17.69,11.7 17.88,11.51 17.88,10.93 17.69,10.74 17.3,10.74 v16.79,10.23 | R5.2 15.22,28.02 D4*.3 20.47,28.02 R4.1 | C10*.1 9.65,28.89 v9.65,25.91
  Bottom 0.406: R5.2 13.65,30.16
  Bottom 0.813: C10*.1 R5.2
KNX_TX
  Bottom 0.254: U$2.2 27.43,27.44 26.74,26.75 25.88,26.75 25.4,26.27 25.4,25.21 26.61,24 | IC1.13 15.45,9.15 16.58,8.02 17.49,8.02 18.12,7.39 24.08,7.39 25.77,9.08 25.77,12.19 26.67,13.09 26.67,22.86 26.74,22.93 26.74,24.13 | 26.74,24.46 26.74,24.13 | R7.2 26.61,24 | 26.61,24 26.74,24.13
LED
  Bottom 0.254: LED1.A 8.03,10.79 IC1.25
N$1
  Bottom 1.016: L3.1 29,37.08 D11.C
N$3
  Bottom 0.508: R6.2 32.88,32.2 U$2.5
N$4
  Bottom 0.254: LED1.K 4.45,9.34 R10.1
N$5
  Bottom 0.203: IC1.10 16.92,12.19 16,12.19 15.88,12.06 15.88,11.56 16.21,11.22 IC1.12
N$7
  Bottom 0.254: IC1.6 18.93,14.22 20.23,12.92 Q1.1 20.57,11.68 C4.1
N$8
  Bottom 0.254: 21.59,16.32 C5.2 22.01,16.38 Q1.2 23.61,14.72 IC1.5
NRST  (via drill 0.35)
  Top 0.254: v21.46,8.1 21.91,8.1 27.85,14.04 27.85,16.31 27.08,17.08 20.51,17.08 17.72,19.88 17.72,20.37 16.68,21.41 16.09,21.41 15.96,21.29 13.86,21.29 13.78,21.21 10.92,21.21 10.16,21.97 8.51,21.97 DBG.1
  Bottom 0.254: IC1.7 16.93,13.7 16.21,13.7 15.44,12.93 15.44,11.38 16.08,10.74 16.08,9.16 16.77,8.47 17.68,8.47 18.06,8.1 v21.46,8.1 | DBG.1 2.03,30.55 C6.1
REF
  Bottom 0.508: 27.85,29.98 U$2.4 28.1,29.98 D5.A
SWCLK  (via drill 0.35)
  Top 0.254: 2.03,25.91 DBG.2 3.56,24.13 v4.26,24.13
  Bottom 0.254: IC1.37 5.91,18.22 4.01,20.12 4.01,23.06 4.26,23.31 v4.26,24.13
SWDIO
  Bottom 0.254: IC1.34 7.01,15.72 4.45,18.29 DBG.5
VDDA  (via drill 0.35)
  Top 0.254: C3.1 17.31,11.5 v18.13,12.32
  Top 0.508: C3.1 15.3,10.79 L1.2
  Bottom 0.254: v18.13,12.32 17.73,12.72 IC1.9